# Altium schematic sheet Base_Buck_Schematic.SchDoc
size A4; SheetNumber: 2; SheetTotal: 2
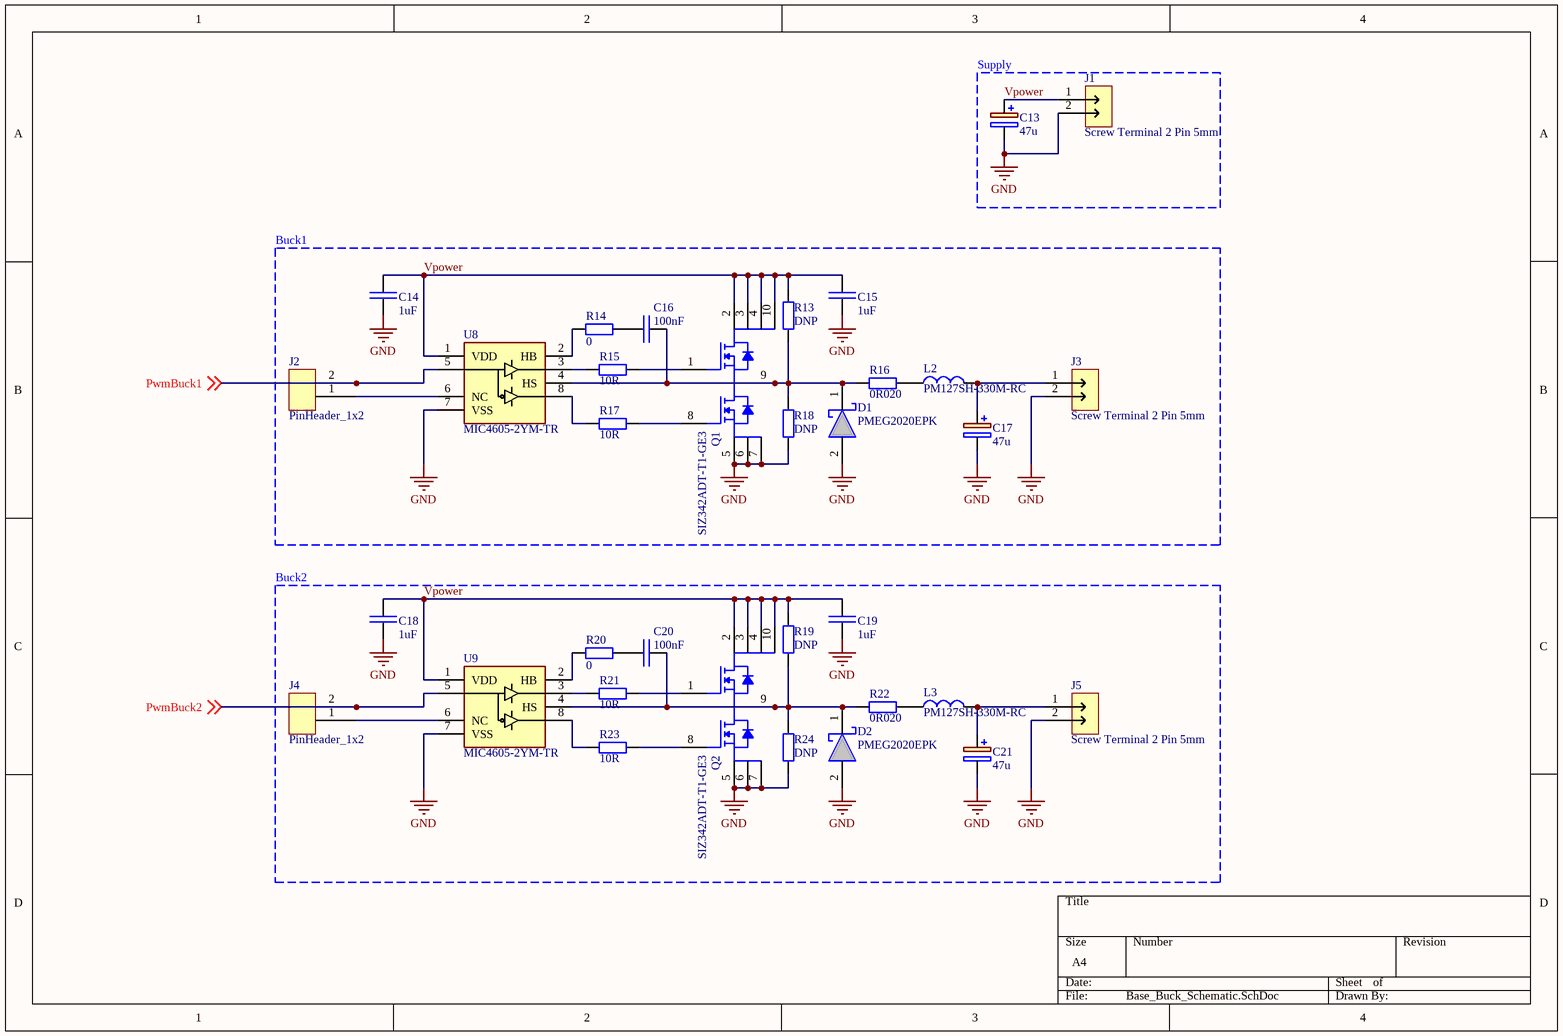
[diagram p0: Base_Buck_Schematic.SchDoc]

## Parts
C13  47u  [CAPAE7366X61N]
C14  1uF  [CAP_SM0805_YAGEOCC2_N]
C15  1uF  [CAP_SM0805_YAGEOCC2_N]
C16  100nF  [CAP_SM0603_YAGEOCC2_N]
C17  47u  [CAPAE7366X61N]
C18  1uF  [CAP_SM0805_YAGEOCC2_N]
C19  1uF  [CAP_SM0805_YAGEOCC2_N]
C20  100nF  [CAP_SM0603_YAGEOCC2_N]
C21  47u  [CAPAE7366X61N]
D1  PMEG2020EPK  [PMEG2020EPK]
D2  PMEG2020EPK  [PMEG2020EPK]
J1  Screw Terminal 2 Pin 5mm  [TB00250002BE]
J2  PinHeader_1x2  [PinHeader_1x2_2.54mm]
J3  Screw Terminal 2 Pin 5mm  [TB00250002BE]
J4  PinHeader_1x2  [PinHeader_1x2_2.54mm]
J5  Screw Terminal 2 Pin 5mm  [TB00250002BE]
L2  PM127SH-330M-RC  [PM127SH330MRC]
L3  PM127SH-330M-RC  [PM127SH330MRC]
Q1  SIZ342ADT-T1-GE3  [SIZ342ADT-T1-GE3]
Q2  SIZ342ADT-T1-GE3  [SIZ342ADT-T1-GE3]
R13  DNP  [RES_SM0603_YAGEORC_N]
R14  0  [RES_SM0603_YAGEORC_N]
R15  10R  [RES_SM0603_YAGEORC_N]
R16  0R020  [MSMA2512R0200FGN]
R17  10R  [RES_SM0603_YAGEORC_N]
R18  DNP  [RES_SM0603_YAGEORC_N]
R19  DNP  [RES_SM0603_YAGEORC_N]
R20  0  [RES_SM0603_YAGEORC_N]
R21  10R  [RES_SM0603_YAGEORC_N]
R22  0R020  [MSMA2512R0200FGN]
R23  10R  [RES_SM0603_YAGEORC_N]
R24  DNP  [RES_SM0603_YAGEORC_N]
U8  MIC4605-2YM-TR  [SOIC127P600X163-8N]
U9  MIC4605-2YM-TR  [SOIC127P600X163-8N]

## Blocks framed on the sheet
Supply: C13 J1
Buck1: C14-C17 D1 J2 J3 L2 Q1 R13-R18 U8
Buck2: C18-C21 D2 J4 J5 L3 Q2 R19-R24 U9

## Nets
GND: C13.2(-) C14.2 C15.2 C17.2(-) C18.2 C19.2 C21.2(-) D1.2(Anode) D2.2(Anode) J1.2 J3.2 J5.2 Q1.5(D) Q1.6(D) Q1.7(D) Q2.5(D) Q2.6(D) Q2.7(D) R18.1 R24.1 U8.7(VSS) U9.7(VSS)
PwmBuck1: J2.2 U8.5(PWM) ; off-sheet PwmBuck1
PwmBuck2: J4.2 U9.5(PWM) ; off-sheet PwmBuck2
Vpower: C13.1(+) C14.1 C15.1 C18.1 C19.1 J1.1 Q1.2(D) Q1.3(D) Q1.4(D) Q1.10(D) Q2.2(D) Q2.3(D) Q2.4(D) Q2.10(D) R13.2 R19.2 U8.1(VDD) U9.1(VDD)
NetC16_1: C16.1 R14.2
NetC16_2: C16.2 D1.1(Cathode) Q1.9(D) R13.1 R16.2 R18.2 U8.4(HS)
NetC17_1: C17.1(+) J3.1 L2.2
NetC20_1: C20.1 R20.2
NetC20_2: C20.2 D2.1(Cathode) Q2.9(D) R19.1 R22.2 R24.2 U9.4(HS)
NetC21_1: C21.1(+) J5.1 L3.2
NetJ2_1: J2.1 U8.6(NC)
NetJ4_1: J4.1 U9.6(NC)
NetL2_1: L2.1 R16.1
NetL3_1: L3.1 R22.1
NetQ1_1: Q1.1(G1) R15.2
NetQ1_8: Q1.8(G2) R17.2
NetQ2_1: Q2.1(G1) R21.2
NetQ2_8: Q2.8(G2) R23.2
NetR14_1: R14.1 U8.2(HB)
NetR15_1: R15.1 U8.3(HO)
NetR17_1: R17.1 U8.8(LO)
NetR20_1: R20.1 U9.2(HB)
NetR21_1: R21.1 U9.3(HO)
NetR23_1: R23.1 U9.8(LO)

## Library data of the parts
C13 C17 C21 = EEE-FK1E470P: Aluminium Electrolytic Capacitors - SMD 47uF 25V; Value: 47u; Supplier 1: Mouser; Supplier Part Number 1: 667-EEE-FK1E470P; Supplier 2: Digi-Key; Supplier Part Number 2: PCE3804CT-ND; Supplier 3: Digi-Key; Supplier Part Number 3: PCE3804DKR-ND
C14 C15 C18 C19 = CC0805KKX7R8BB105: CAP 1uF SM0805 X7R 25V YAGEO CC2; Tolerance (%): 10; Voltage Rating (Volts): 25; Category: Capacitor; Manufacturer: Yageo; Manufacturer Part Number: CC0805KKX7R8BB105; Package: 0805; Value: 1uF; ComponentLink1URL: http://www.yageo.com; ComponentLink1Description: Manufacturer Website; Supplier 1: Farnell; Supplier Part Number 1: 1458903; Supplier 2: Digikey; Supplier Part Number 2: 311-1456-1-ND; Supplier 3: Mouser; Supplier Part Number 3: 603-CC805KKX7R8BB105; Supplier 4: Future Electronics; Supplier Part Number 4: 7716954; Supplier 5: Arrow Electronics; Supplier Part Number 5: CC0805KKX7R8BB105; Supplier 6: Rs; Supplier Part Number 6: 1988104; Supplier 7: Digikey; Supplier Part Number 7: 311-1456-6-ND
C16 C20 = CC0603KRX7R9BB104: CAP 100nF SM0603 X7R 50V YAGEO CC2; Tolerance (%): 10; Voltage Rating (Volts): 50; Category: Capacitor; Manufacturer: Yageo; Manufacturer Part Number: CC0603KRX7R9BB104; Package: 0603; Value: 100nF; ComponentLink1URL: http://www.yageo.com; ComponentLink1Description: Manufacturer Website; Supplier 1: Mouser; Supplier Part Number 1: 603-CC603KRX7R9BB104; Supplier 2: Future Electronics; Supplier Part Number 2: 3035896; Supplier 3: Future Electronics; Supplier Part Number 3: 9017302; Supplier 4: Arrow Electronics; Supplier Part Number 4: CC0603KRX7R9BB104; Supplier 5: Rs; Supplier Part Number 5: 6698767; Supplier 6: Avnet; Supplier Part Number 6: 68R4788; Supplier 7: Digikey; Supplier Part Number 7: 311-1344-1-ND; Supplier 8: Digikey; Supplier Part Number 8: 311-1344-6-ND
D1 D2 = PMEG2020EPK: PMEG2020EPK 20 V, 2 A low VF MEGA Schottky barrier rectifier; Supplier 1: Digikey; Supplier Part Number 1: 1727-1338-1-ND; Supplier 2: Digikey; Supplier Part Number 2: 1727-1338-6-ND; Supplier 3: Farnell; Supplier Part Number 3: 2191802; Supplier 4: Mouser; Supplier Part Number 4: 771-PMEG2020EPK,315; Supplier 5: LCSC; Supplier Part Number 5: C552841
J1 J3 J5 = TB00250002BE: Fixed Terminal Blocks Terminal block, screw type, 5.00, horizontal, 2 poles, CUI Blue, slotted screw, PCB mount
J2 J4 = PinHeader_1x2_2.54mm: PinHeader_1x2 2.54mm Pitch
L2 L3 = PM127SH-330M-RC: Bourns PM127SH Series Shielded Wire-wound SMD Inductor with a Ferrite Core, 33 uH +/-20% Wire-Wound 3.5A Idc Q:28; Geometry.Height: 8mm; Mouser Part Number: 542-PM127SH-330M-RC; Mouser Price/Stock: https://www.mouser.co.uk/ProductDetail/Bourns/PM127SH-330M-RC?qs=eR5JJ6cMb%252Bbm7NbWn3468w%3D%3D; Manufacturer_Name: Bourns; Manufacturer_Part_Number: PM127SH-330M-RC; Datasheet Link: https://www.bourns.com/docs/Product-Datasheets/pm127sh_series.pdf; Supplier 1: Digi-Key; Supplier Part Number 1: PM127SH-330M-RCCT-ND; Supplier 2: Digi-Key; Supplier Part Number 2: PM127SH-330M-RCDKR-ND; Supplier 3: Mouser; Supplier Part Number 3: 542-PM127SH-330M-RC
Q1 Q2 = SIZ342ADT-T1-GE3: MOSFET 30V Vds 20V Vgs PowerPAIR 3 x 3; Manufacturer_Name: Vishay Semiconductors; Geometry.Height: 0.8mm; Mouser Part Number: 78-SIZ342ADT-T1-GE3; Manufacturer_Part_Number: SIZ342ADT-T1-GE3; Datasheet Link: https://www.vishay.com/doc?76711; Supplier 1: Mouser; Supplier Part Number 1: 78-SIZ342ADT-T1-GE3
R13 R18 R19 R24 = RC0603FR-073K3L: RES 3K3 SM0603 YAGEO RC_L; Manufacturer Part Number: RC0603FR-0710KL; Power (Watts): 0.1; Resistance (Ohms): 10000; Tolerance (%): 1; Category: Resistor; Manufacturer: Yageo; Package: 0603; Value: 3K3; ComponentLink1Description: Manufacturer Website; ComponentLink1URL: http://www.yageo.com; Supplier 1: Rs; Supplier Part Number 1: 1995564; Supplier 2: Farnell; Supplier Part Number 2: 9238549; Supplier 3: Digikey; Supplier Part Number 3: 311-3.30KHRCT-ND; Supplier 4: Digikey; Supplier Part Number 4: 311-3.30KHRDKR-ND; Supplier 5: Mouser; Supplier Part Number 5: 603-RC0603FR-073K3L; Supplier 6: Newark; Supplier Part Number 6: 98K7393
R14 R20 = RC0603FR-070RL: RES 0R SM0603 YAGEO RC_L; Manufacturer Part Number: RC0603FR-0710KL; Power (Watts): 0.1; Resistance (Ohms): 10000; Tolerance (%): 1; Category: Resistor; Manufacturer: Yageo; Package: 0603; Value: 0; ComponentLink1Description: Manufacturer Website; ComponentLink1URL: http://www.yageo.com; Supplier 1: Digikey; Supplier Part Number 1: 311-0.0HRCT-ND; Supplier 2: Digikey; Supplier Part Number 2: 311-0.0HRDKR-ND; Supplier 3: Farnell; Supplier Part Number 3: 2309106; Supplier 4: Mouser; Supplier Part Number 4: 603-RC0603FR-070RL; Supplier 5: Newark; Supplier Part Number 5: 50Y7761
R15 R17 R21 R23 = RC0603FR-0710RL: RES 10R SM0603 YAGEO RC_L; Power (Watts): 0.1; Resistance (Ohms): 10; Tolerance (%): 1; Category: Resistor; Manufacturer: Yageo; Manufacturer Part Number: RC0603FR-0710RL; Package: 0603; Value: 10R; Supplier Part Number 1: 9238247; Supplier 1: Farnell; ComponentLink1URL: http://www.yageo.com; ComponentLink1Description: Manufacturer Website; Supplier 2: Digi-Key; Supplier Part Number 2: 311-10.0HRCT-ND
R16 R22 = MSMA2512R0200FGN: RES SM0603YAGEO RC_L; Value: 0R020; Supplier 1: Digi-Key; Supplier Part Number 1: 283-MSMA2512R0200FGNCT-ND; Supplier 2: Digi-Key; Supplier Part Number 2: 283-MSMA2512R0200FGNDKR-ND; Supplier 3: Mouser; Supplier Part Number 3: 504-MSMA2512R0200FGN
U8 U9 = MIC4605-2YM-TR: Gate Drivers 85V Half Bridge MOSFET Driver; Manufacturer_Name: Microchip; Geometry.Height: 1.63mm; Mouser Part Number: 998-MIC4605-2YM-TR; Mouser Price/Stock: https://www.mouser.co.uk/ProductDetail/Microchip-Technology/MIC4605-2YM-TR?qs=U6T8BxXiZAVl8W1xjIUxZQ%3D%3D; Manufacturer_Part_Number: MIC4605-2YM-TR; Datasheet Link: http://www.microchip.com/mymicrochip/filehandler.aspx?ddocname=en579235; Supplier 1: Arrow Electronics; Supplier Part Number 1: MIC4605-2YM-TR; Supplier 2: Digi-Key; Supplier Part Number 2: 576-4463-1-ND; Supplier 3: Digi-Key; Supplier Part Number 3: 576-4463-6-ND; Supplier 4: Mouser; Supplier Part Number 4: 998-MIC4605-2YM-TR